# EAGLE schematic D7 3055 (EAGLE 9.6.1)
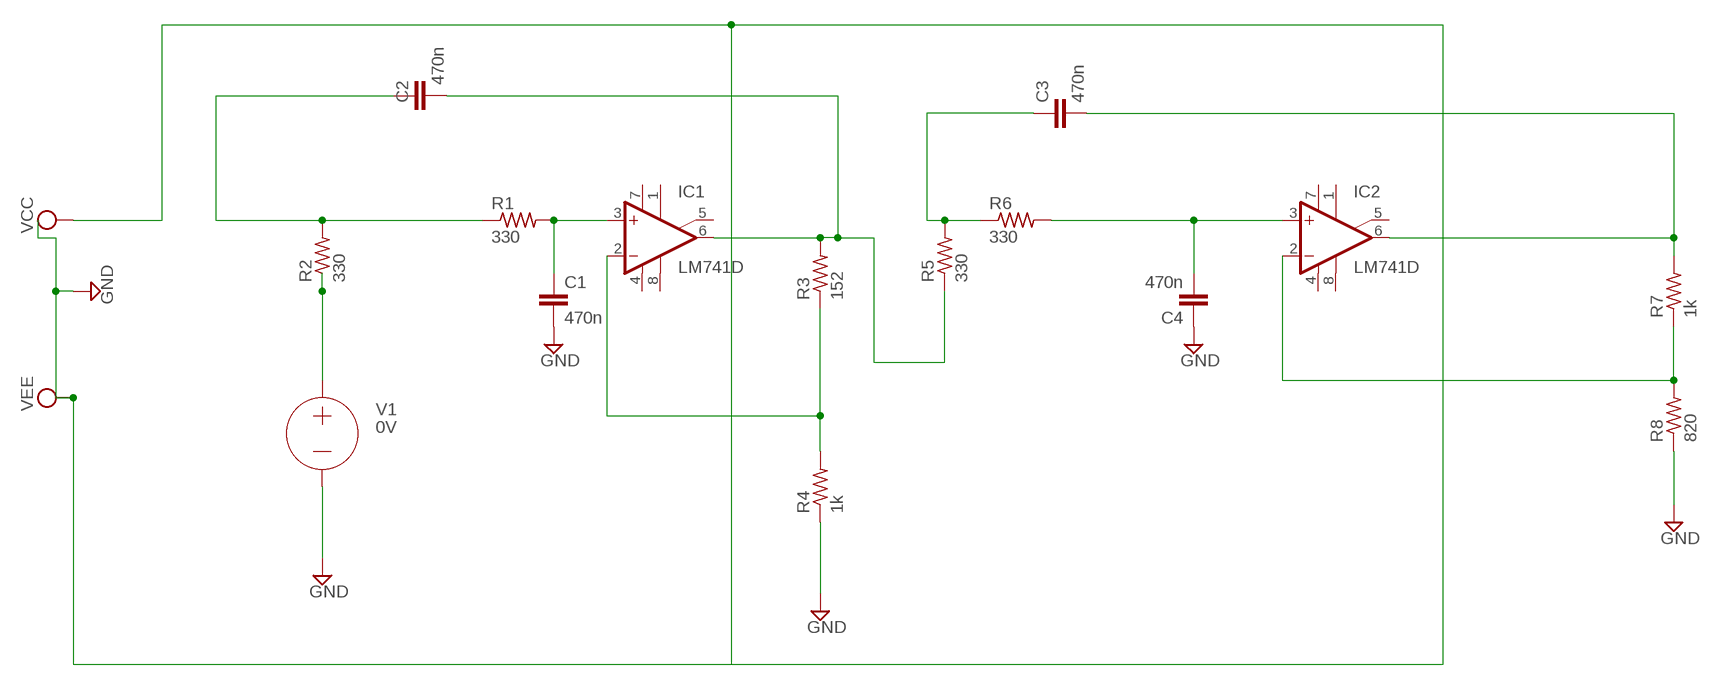
[diagram p0: schematic, sheet 1]

## Parts
C1  470n  C2,5-3  [C2.5-3]
C2  470n  C2,5-3  [C2.5-3]
C3  470n  C2,5-3  [C2.5-3]
C4  470n  C2,5-3  [C2.5-3]
IC1  LM741D  [SO08]
IC2  LM741D  [SO08]
R1  330  R-US_0204/7  [0204/7]
R2  330  R-US_0204/7  [0204/7]
R3  152  R-US_0204/7  [0204/7]
R4  1k  R-US_0204/7  [0204/7]
R5  330  R-US_0204/7  [0204/7]
R6  330  R-US_0204/7  [0204/7]
R7  1k  R-US_0204/7  [0204/7]
R8  820  R-US_0204/7  [0204/7]
V1  0V  VOLTAGE  (no package)

## Nets
GND: C1.2 C4.1 R4.1 R8.1 V1.-
N$1: C2.1 R1.1 R2.2
N$2: R2.1 V1.+
N$3: C1.1 IC1.3(+IN) R1.2
N$4: C3.1 R5.2 R6.1
N$5: C2.2 IC1.6(OUT) R3.2 R5.1
N$6: IC1.2(-IN) R3.1 R4.2
N$7: C3.2 IC2.6(OUT) R7.2
N$8: C4.2 IC2.3(+IN) R6.2
N$10: IC2.2(-IN) R7.1 R8.2
Unconnected: IC1.1(ON1) IC1.5(ON2) IC1.8(OPT) IC2.1(ON1) IC2.5(ON2) IC2.8(OPT)

## Power pins joined to a net without a drawn wire
V+: IC1.7(V+) IC2.7(V+)
V-: IC1.4(V-) IC2.4(V-)

## Library data of the parts
C1-C4 = capacitor-wima:C: CAPACITOR naming: grid - package width
IC1 IC2 = linear:*741: OP AMP
R1-R8 = rcl:R-US_: RESISTOR, American symbol; SPICEPREFIX: R
V1 = ngspice-simulation:VOLTAGE: Independent Voltage Source, either DC, AC, PULSE, SINE, PWL, EXP, or SFFM